# Altium schematic sheet STM32F4.SchDoc
size A4; SheetNumber: 6; SheetTotal: 7
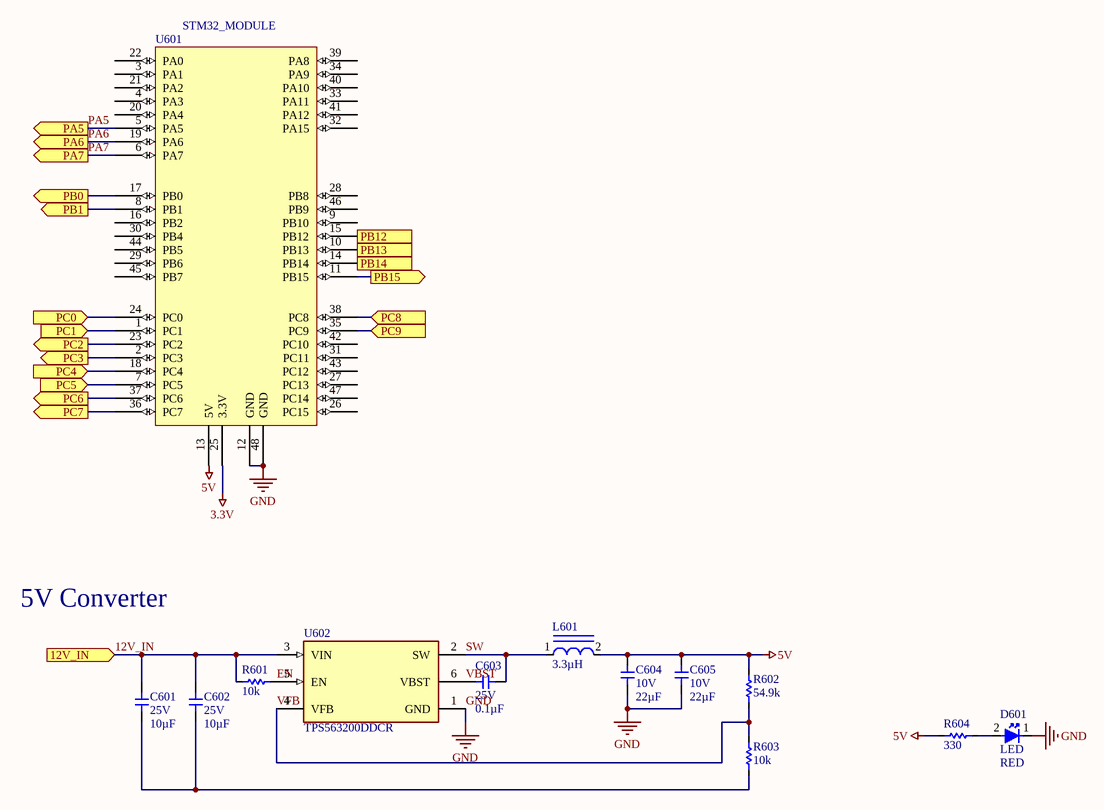
[diagram p0: STM32F4.SchDoc]

## Parts
C601  Voltage: 25V  Capacitance: 10µF  [0805]  (hidden comment: non-polar_Capacitor)
C602  Voltage: 25V  Capacitance: 10µF  [0805]  (hidden comment: non-polar_Capacitor)
C603  Voltage: 25V  Capacitance: 0.1µF  [0805]  (hidden comment: non-polar_Capacitor)
C604  Voltage: 10V  Capacitance: 22µF  [0805]  (hidden comment: non-polar_Capacitor)
C605  Voltage: 10V  Capacitance: 22µF  [0805]  (hidden comment: non-polar_Capacitor)
D601  LED  Color: RED  [SMD_LED]
L601  Inductance: 3.3µH  [FP-SRP7030CA-MFG]  (hidden comment: inductor_SRP7030CA)
R601  Resistance: 10k  [0805]  (hidden comment: Resistor)
R602  Resistance: 54.9k  [0805]  (hidden comment: Resistor)
R603  Resistance: 10k  [0805]  (hidden comment: Resistor)
R604  Resistance: 330  [SMD_Resistor]  (hidden comment: Resistor)
U601  STM32_MODULE  [DIP_STM32_MODULE]
U602  TPS563200DDCR  [FP-DDC0006A-MFG]

## Ports
12V_IN (in), PA5 (out), PA6 (out), PA7 (out), PB0 (out), PB1 (out), PB12 (in), PB13 (in), PB14 (out), PB15 (out), PC0 (in), PC1 (in), PC2 (out), PC3 (out), PC4 (in), PC5 (in), PC6 (out), PC7 (out), PC8 (in), PC9 (in)

## Nets
3.3V: U601.25(3.3V)
5V: C604.2 C605.2 L601.2 R602.2 R604.1 U601.13(5V)
GND: C604.1 C605.1 D601.1 U601.12(GND) U601.48(GND) U602.1(GND)
12V_IN: C601.2 C602.2 R601.1 U602.3(VIN) ; port 12V_IN
EN: R601.2 U602.5(EN)
PA5: U601.5(PA5) ; port PA5
PA6: U601.19(PA6) ; port PA6
PA7: U601.6(PA7) ; port PA7
PB0: U601.17(PB0) ; port PB0
PB1: U601.8(PB1) ; port PB1
PB12: U601.15(PB12) ; port PB12
PB13: U601.10(PB13) ; port PB13
PB14: U601.14(PB14) ; port PB14
PB15: U601.11(PB15) ; port PB15
PC0: U601.24(PC0) ; port PC0
PC1: U601.1(PC1) ; port PC1
PC2: U601.23(PC2) ; port PC2
PC3: U601.2(PC3) ; port PC3
PC4: U601.18(PC4) ; port PC4
PC5: U601.7(PC5) ; port PC5
PC6: U601.37(PC6) ; port PC6
PC7: U601.36(PC7) ; port PC7
PC8: U601.38(PC8) ; port PC8
PC9: U601.35(PC9) ; port PC9
SW: C603.2 L601.1 U602.2(SW)
VBST: C603.1 U602.6(VBST)
VFB: R602.1 R603.2 U602.4(VFB)
NetC601_1: C601.1 C602.1 R603.1
NetD601_2: D601.2 R604.2

Not connected (* = marked no-connect by the designer): U601 3(PA1) 4(PA3) 9(PB10) 16(PB2) 20(PA4) 21(PA2) 22(PA0) 26(PC15) 27(PC13) 28(PB8) 29(PB6) 30(PB4) 31(PC11) 32(PA15) 33(PA11) 34(PA9) 39(PA8) 40(PA10) 41(PA12) 42(PC10) 43(PC12) 44(PB5) 45(PB7) 46(PB9) 47(PC14)

## Notes on the sheet
- 5V Converter

## Library data of the parts
C601-C605 = CMP-024-000020-15: SMD type ceramic capacitor; Design Item ID: Capacitor; Source: robit_passive.SchLib
D601 = CMP-026-000008-1: Light Emitting Diode; Design Item ID: LED; Source: robit_passive.SchLib
L601 = CMP-028-000006-1: General Purpose Inductor, 6.8uH, 20%, 1 Element, Powdered Metal Alloy-Core, SMD, 3130
R601-R603 = CMP-029-000004-8: SMD type resistor; Design Item ID: Resistor; Source: robit_passive.SchLib
R604 = CMP-029-000004-1: SMD type resistor; Design Item ID: Resistor; Source: robit_passive.SchLib
U601 = CMP-021-000010-1: processor; Source: robit_ic.SchLib; Design Item ID: STM32_MODULE
U602 = CMP-04918-000155-1: IC REG BUCK ADJ 3A TSOT23-6; Quiescent Current: 190uA; Output Voltage: 7V; Min Input Voltage: 4.5V; Output Configuration: Positive; Number of Outputs: 1; Switching Frequency: 650kHz; Synchronous Rectifier: Yes; Min Output Voltage: 760mV; Output Type: Adjustable; Operating Supply Voltage: 17V; Max Operating Temperature: 125°C; Lead Free: Lead Free; Packaging: Tape and Reel; Radiation Hardening: No; Mount: Surface Mount; Contact Plating: Tin; Output Current: 3A; Max Output Voltage: 7V; Min Operating Temperature: -40°C; Case/Package: SOT-23-6; Max Output Current: 3A; Max Input Voltage: 17V